# Altium schematic sheet 007_Parallel_operation.SchDoc
size A4; Organization: OLTEST; Revision: 01; SheetNumber: 7; SheetTotal: 12; Название листа: Название листа; Разработчик: Бондарчук С.; Прибор: R100; АМАК.000000.000 Э3: R100.220.040.000 Э3; Дата: 14.01.2018; Формат: A4
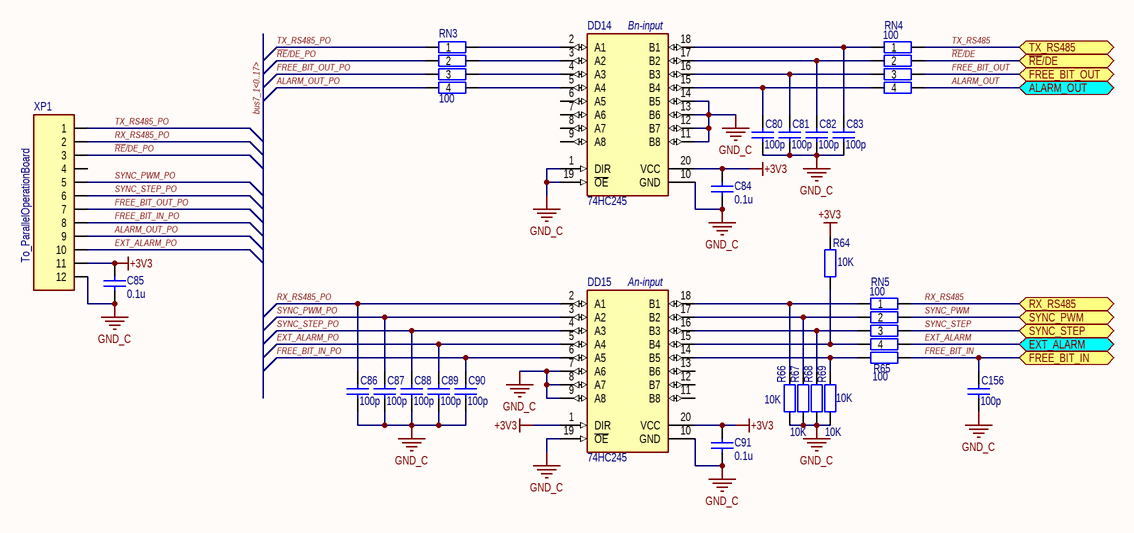
[diagram p0: 007_Parallel_operation.SchDoc]

## Parts
C80  100p  [SMD_C_0603]
C81  100p  [SMD_C_0603]
C82  100p  [SMD_C_0603]
C83  100p  [SMD_C_0603]
C84  0.1u  [SMD_C_0603]
C85  0.1u  [SMD_C_0603]
C86  100p  [SMD_C_0603]
C87  100p  [SMD_C_0603]
C88  100p  [SMD_C_0603]
C89  100p  [SMD_C_0603]
C90  100p  [SMD_C_0603]
C91  0.1u  [SMD_C_0603]
C156  100p  [SMD_C_0603]
DD14  74HC245  [TSSOP20]
DD15  74HC245  [TSSOP20]
R64  10K  [SMD_R_0603]
R65  100  [SMD_R_0603]
R66  10K  [SMD_R_0603]
R67  10K  [SMD_R_0603]
R68  10K  [SMD_R_0603]
R69  10K  [SMD_R_0603]
RN3  100  [CRA06S]
RN4  100  [CRA06S]
RN5  100  [CRA06S]
XP1  То_ParallelOperationBoard  [XP(ParallelOperation)]

## Ports
ALARM_OUT (bidir), EXT_ALARM, FREE_BIT_IN, FREE_BIT_OUT (bidir), RX_RS485, SYNC_PWM, SYNC_STEP, TX_RS485 (bidir), ~{RE}/DE (bidir)

## Nets
+3V3: C84.2 C85.2 C91.2 DD14.20(VCC) DD15.1(DIR) DD15.20(VCC) R64.2 XP1.11
GND_C: C80.1 C81.1 C82.1 C83.1 C84.1 C85.1 C86.1 C87.1 C88.1 C89.1 C90.1 C91.1 C156.1 DD14.1(DIR) DD14.10(GND) DD14.11(B8) DD14.12(B7) DD14.13(B6) DD14.14(B5) DD14.19(~{OE}) DD15.7(A6) DD15.8(A7) DD15.9(A8) DD15.10(GND) DD15.19(~{OE}) R66.1 R67.1 R68.1 R69.1 XP1.12
~{RE}/DE: RN4.7 ; port ~{RE}/DE
~{RE}/DE_PO: RN3.2 XP1.3
ALARM_OUT: RN4.5 ; port ALARM_OUT
ALARM_OUT_PO: RN3.4 XP1.9
EXT_ALARM: RN5.5 ; port EXT_ALARM
EXT_ALARM_PO: C89.2 DD15.5(A4) XP1.10
FREE_BIT_IN: C156.2 R65.2 ; port FREE_BIT_IN
FREE_BIT_IN_PO: C90.2 DD15.6(A5) XP1.8
FREE_BIT_OUT: RN4.6 ; port FREE_BIT_OUT
FREE_BIT_OUT_PO: RN3.3 XP1.7
RX_RS485: RN5.8 ; port RX_RS485
RX_RS485_PO: C86.2 DD15.2(A1) XP1.2
SYNC_PWM: RN5.7 ; port SYNC_PWM
SYNC_PWM_PO: C87.2 DD15.3(A2) XP1.5
SYNC_STEP: RN5.6 ; port SYNC_STEP
SYNC_STEP_PO: C88.2 DD15.4(A3) XP1.6
TX_RS485: RN4.8 ; port TX_RS485
TX_RS485_PO: RN3.1 XP1.1
NetC80_2: C80.2 DD14.15(B4) RN4.4
NetC81_2: C81.2 DD14.16(B3) RN4.3
NetC82_2: C82.2 DD14.17(B2) RN4.2
NetC83_2: C83.2 DD14.18(B1) RN4.1
NetDD14_2: DD14.2(A1) RN3.8
NetDD14_3: DD14.3(A2) RN3.7
NetDD14_4: DD14.4(A3) RN3.6
NetDD14_5: DD14.5(A4) RN3.5
NetDD15_14: DD15.14(B5) R65.1 R69.2
NetDD15_15: DD15.15(B4) R64.1 RN5.4
NetDD15_16: DD15.16(B3) R68.2 RN5.3
NetDD15_17: DD15.17(B2) R67.2 RN5.2
NetDD15_18: DD15.18(B1) R66.2 RN5.1

Not connected (* = marked no-connect by the designer): DD14 6(A5) 7(A6) 8(A7) 9(A8); DD15 11(B8) 12(B7) 13(B6); XP1 4

## Buses and harness runs
bus bus7_1<0..17>

## Notes on the sheet
- (near DD14) Bn-input
- (near DD15) An-input
- Разработчик:
- Формат:
- Rev.:
- Лист
- Дата:
- Листов
- WorkSpace:
- Дата изм.:

## Library data of the parts
C80-C83 C86-C90 C156 = C0603 100p 100V 5%: SMD C 0603 MURATA 100V 5% NP0; PartNumber: GRM1885C2A101JA01; Manufacturer: MURATA; Value: 100p
C84 C85 C91 = C0603 0.1u 50V 10%: SMD C 0603 MURATA 50V 10% X7R; PartNumber: GRM188R71H104K; Manufacturer: MURATA; Value: 0.1u
DD14 = 74HC245: Octal Bus Transceivers With 3-State Outputs, PW0020A; Manufacturer: Texas Instruments; PartNumber: 74HC245PW; PackageReference: PW0020A
DD15 = 74HC245: Octal Bus Transceivers With 3-State Outputs, PW0020A; Manufacturer: Texas Instruments; PartNumber: SN74HC245PW; VCC(Min)(V): 2; VCC(Max)(V): 6; Output Type: CMOS; ICC @ Nom Voltage(Max)(mA): 0.08; Bits(#): 8; F @ Nom Voltage(Max)(Mhz): 28; Rating: Catalog; Technology Family: HC; Schmitt Trigger: No; Output Drive (IOL/IOH)(Max)(mA): -6/6; tpd @ Nom Voltage(Max)(ns): 22; DatasheetVersion: SCLS131D; PackageReference: PW0020A; Input Type: CMOS; Operating Temperature Range(C): -40 to 85; Voltage(Nom)(V): 6
R64 R66-R69 = R0603 10К 1%: SMD R 0603 VISHAY 0.1W 75V 1% 100ppm; PartNumber: CRCW060310K0FK; Manufacturer: VISHAY; Value: 10K
R65 = R0603 100 1%: SMD R 0603 VISHAY 0.1W 75V 1% 100ppm; PartNumber: CRCW0603100RFK; Manufacturer: VISHAY; Value: 100
RN3-RN5 = CRA06S 4x100 1%: SMD RESISTOR ARRAY VISHAY 0.063W 50V 1% 100ppm; PartNumber: CRA06S083100RF; Manufacturer: VISHAY; Value: 100
XP1 = Plata_ParallelOperation: to ParallelOperationBoard; PartNumber: R100.20.62.10.00; Manufacturer: OLTEST